# EAGLE design SpectroSlave (EAGLE 7.1.0)
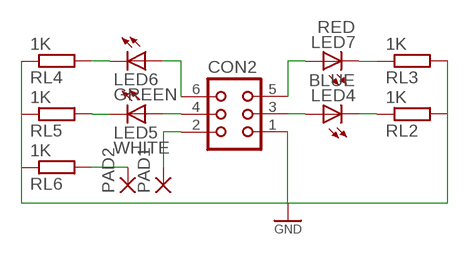
[diagram p0: schematic, sheet 1]

## Parts
CON2  CON06L  [CON06L]
LED4  BLUE  LED3MM  [LED3MM]
LED5  WHITE  LED3MM  [LED3MM]
LED6  GREEN  LED3MM  [LED3MM]
LED7  RED  LED3MM  [LED3MM]
PAD1  SMD5  [SMD2,54-5,08]
PAD2  SMD5  [SMD2,54-5,08]
RL2  1K  R-EU_R0805  [R0805]
RL3  1K  R-EU_R0805  [R0805]
RL4  1K  R-EU_R0805  [R0805]
RL5  1K  R-EU_R0805  [R0805]
RL6  1K  R-EU_R0805  [R0805]

## Nets
GND [power]: CON2.1 RL2.2 RL3.2 RL4.1 RL5.1 RL6.1
N$1: CON2.4 LED5.A
N$2: CON2.6 LED6.A
N$3: LED6.K(C) RL4.2
N$4: CON2.2 PAD1.1(P)
N$5: LED7.K(C) RL3.1
N$6: LED4.K(C) RL2.1
N$7: CON2.3 LED4.A
N$8: PAD2.1(P) RL6.2
N$9: CON2.5 LED7.A
N$10: LED5.K(C) RL5.2

## Library data of the parts
CON2 = con-harting:CON06L: CONNECTOR; OC_FARNELL: unknown; OC_NEWARK: unknown
LED4-LED7 = led:LED: LED OSRAM: - CHIPLED LG R971, LG N971, LY N971, LG Q971, LY Q971, LO R971, LY R971 LH N974, LH R974 LS Q976, LO Q976, LY Q976 LO Q996 - Hyper CHIPLED LW Q18S LB Q993, LB Q99A, LB R99A - SideLED LS A670, LO A670, LY A670, LG A670, LP A670 LB A673, LV A673, LT A673, LW A673 LH A674 LY A675 LS A676, LA A676, LO A676, LY A676, LW A676 LS A679, LY A679, LG A679 - Hyper Micro SIDELED® LS Y876, LA Y876, LO Y876, LY Y876 LT Y87S - SmartLED LW L88C, LW L88S LB L89C, LB L89S, LG L890 LS L89K, LO L89K, LY L89K LS L896, LA L896, LO L896, LY L896 - TOPLED LS T670, LO T670, LY T670, LG T670, LP T670 LSG T670, LSP T670, LSY T670, LOP T670, LYG T670 LG T671, LOG T671, LSG T671 LB T673, LV T673, LT T673, LW T673 LH T674 LS T676, LA T676, LO T676, LY T676, LB T676, LH T676, LSB T676, LW T676 LB T67C, LV T67C, LT T67C, LS T67K, LO T67K, LY T67K, LW E67C LS E67B, LA E67B, LO E67B, LY E67B, LB E67C, LV E67C, LT E67C LW T67C LS T679, LY T679, LG T679 LS T770, LO T770, LY T770, LG T770, LP T770 LB T773, LV T773, LT T773, LW T773 LH T774 LS E675, LA E675, LY E675, LS T675 LS T776, LA T776, LO T776, LY T776, LB T776 LHGB T686 LT T68C, LB T68C - Hyper Mini TOPLED® LB M676 - Mini TOPLED Santana® LG M470 LS M47K, LO M47K, LY M47K Source: http://www.osram.convergy.de LUXEON: - LUMILED® LXK2-PW12-R00, LXK2-PW12-S00, LXK2-PW14-U00, LXK2-PW14-V00 LXK2-PM12-R00, LXK2-PM12-S00, LXK2-PM14-U00 LXK2-PE12-Q00, LXK2-PE12-R00, LXK2-PE12-S00, LXK2-PE14-T00, LXK2-PE14-U00 LXK2-PB12-K00, LXK2-PB12-L00, LXK2-PB12-M00, LXK2-PB14-N00, LXK2-PB14-P00, LXK2-PB14-Q00 LXK2-PR12-L00, LXK2-PR12-M00, LXK2-PR14-Q00, LXK2-PR14-R00 LXK2-PD12-Q00, LXK2-PD12-R00, LXK2-PD12-S00 LXK2-PH12-R00, LXK2-PH12-S00 LXK2-PL12-P00, LXK2-PL12-Q00, LXK2-PL12-R00 Source: www.luxeon.com KINGBRIGHT: KA-3528ASYC Source: www.kingbright.com
PAD1 PAD2 = wirepad:SMD5: SMD PAD
RL2-RL6 = rcl:R-EU_: RESISTOR, European symbol

## Net classes
0 default: width 0.356 mm
1 power: width 0.356 mm
2 VIN: width 0.356 mm
3 fine: width 0.356 mm
4 aref: width 0.356 mm

## Board
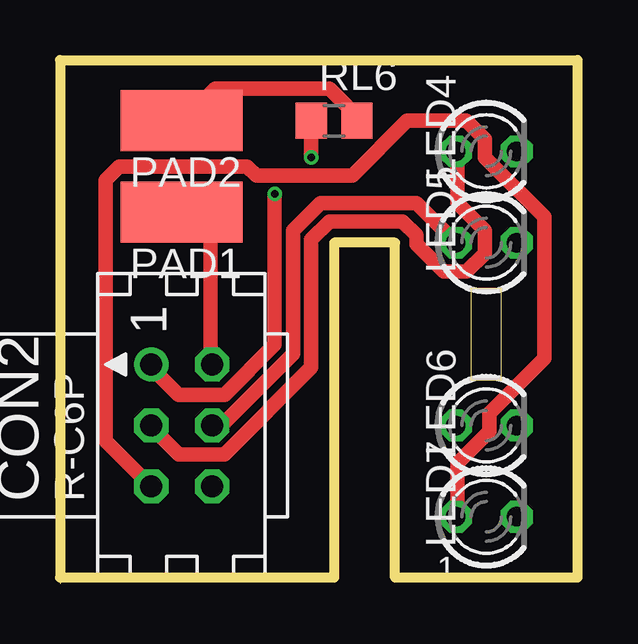
[diagram p1: board, top side]
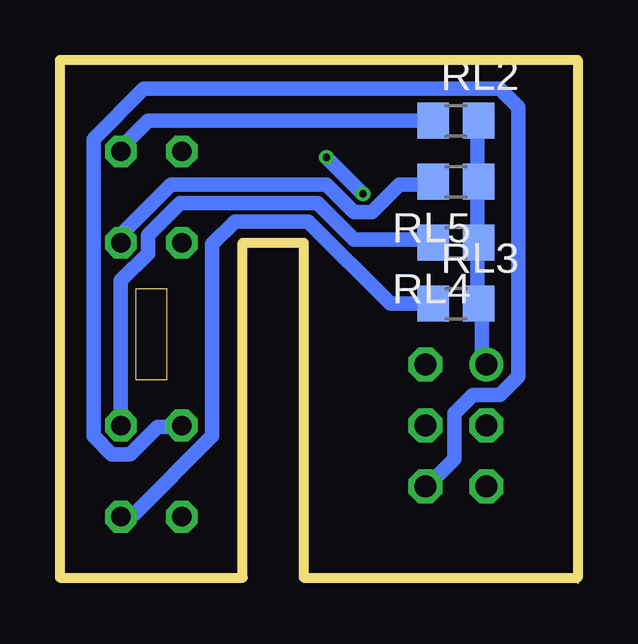
[diagram p2: board, bottom side, seen from below]

Size 21.59 x 21.84 mm. Coordinates in mm from the lower left corner, seen from the top.
Outline: 0,0.25 0,0
Outline: 0,0.25 0,21.84 21.59,21.84 21.59,0.25 13.97,0.25 13.97,14.22 11.43,14.22 11.43,0.25 0,0.25
Copper layers (1*16): Top 0.035mm / dielectric 1.5mm / Bottom 0.035mm
Design rules "Fusion_eagle_rule_v1.1": minimum track width 6mil, minimum drill 12mil, track to track 6mil, track to pad 6mil, pad to pad 6mil, via to via 6mil, smd to smd 0mil, copper to edge 10mil, drill to drill 10mil, minimum pad ring 10mil, minimum via ring 6mil, stop-mask expansion 2mil, vias tented up to drill 100mil, thermal gap 10mil

### Footprints (pad centres in the part's own frame; a part is rotated, then mirrored left to right if it is on the bottom)
CON06L = drill 0.914: 1 2.54,1.27 | drill 0.914 octagon: 2 2.54,-1.27; 3 0,1.27; 4 0,-1.27; 5 -2.54,1.27; 6 -2.54,-1.27
LED3MM = drill 0.813 octagon: A -1.27,0; K 1.27,0
SMD2,54-5,08 = smd 2.54 x 5.08: 1 0,0
R0805 = smd 1.3 x 1.5: 1 -0.95,0; 2 0.95,0

### Placement (x,y rotation side)
CON2  5.08,6.6 90 top
LED4  17.78,18.03 0 top
LED5  17.78,14.22 0 top
LED6  17.78,6.6 0 top
LED7  17.78,2.79 0 top
PAD1  5.08,15.49 90 top
PAD2  5.08,19.3 90 top
RL2  5.08,19.3 0 bottom
RL3  5.08,11.68 0 bottom
RL4  5.08,14.22 180 bottom
RL5  5.08,16.76 180 bottom
RL6  11.43,19.3 0 top

### Tracks (layer width: path | path; a pad name or v marks a point on that pad's centre or on a via)
GND  (via drill 0.3)
  Top 0.61: v10.48,17.78 RL6.1 | v8.95,16.26 8.95,9.97 6.86,7.87 4.95,7.87 3.81,9.02 CON2.1
  Bottom 0.61: RL2.2 4.19,19.3 4.19,17.02 RL5.1 4.19,16.64 4.19,14.35 RL4.1 4.19,14.16 4.19,11.68 RL3.2 4,11.49 4,9.4 3.81,9.21 CON2.1 | v8.95,16.26 v10.48,17.78
N$1
  Top 0.61: LED5.A 14.86,15.88 10.86,15.88 9.72,14.73 9.72,9.59 6.86,6.73 6.48,6.73 CON2.4
N$2
  Bottom 0.61: LED6.A 16.57,6.54 17.53,6.54 18.67,5.4 19.43,5.4 20.19,6.16 20.19,18.54 18.1,20.64 3.24,20.64 2.48,19.88 2.48,8.64 3.24,7.87 4.38,7.87 5.14,7.11 5.14,5.21 6.29,4.06 CON2.6
N$3
  Bottom 0.61: LED6.K 19.05,12.64 17.91,13.78 17.91,14.54 16.57,15.88 10.86,15.88 9.34,14.35 6.1,14.35 RL4.2
N$4
  Top 0.61: CON2.2 6.29,9.21 6.29,14.35 5.14,15.49 PAD1.1
N$5
  Bottom 0.61: RL3.1 7.81,11.68 11.24,15.11 14.29,15.11 15.24,14.16 15.24,6.16 18.48,2.92 19.05,2.92 LED7.K
N$6
  Bottom 0.61: RL2.1 17.91,19.3 19.05,18.16 LED4.K
N$7
  Top 0.61: LED4.A 16.57,17.97 16.57,15.88 17.72,14.73 17.72,13.78 16.95,13.02 16,13.02 14.86,14.16 14.86,14.54 14.29,15.11 11.24,15.11 10.48,14.35 10.48,9.02 6.86,5.4 4.95,5.4 3.81,6.54 CON2.3
N$8
  Top 0.61: RL6.2 12.19,19.3 12.19,19.69 11.24,20.64 6.48,20.64 5.14,19.3 PAD2.1
N$9
  Top 0.61: CON2.5 1.91,5.97 1.91,16.83 2.48,17.4 7.81,17.4 8.19,17.02 12.19,17.02 14.48,19.3 16.95,19.3 17.72,18.54 17.72,17.78 20.19,15.3 20.19,9.4 17.91,7.11 17.91,6.35 16.57,5.02 16.57,2.92 LED7.A
N$10
  Bottom 0.61: LED5.K 19.05,14.54 16.95,16.64 10.48,16.64 9.34,15.49 8.57,15.49 7.43,16.64 6.1,16.64 RL5.2

### Text on the board
tNames: 1
203bmp: C:/Users/G/Pictures/logo_epfl.bmp